# Altium schematic sheet main.SchDoc: Main
size A4; Revision: 1; SheetNumber: 1; SheetTotal: 2
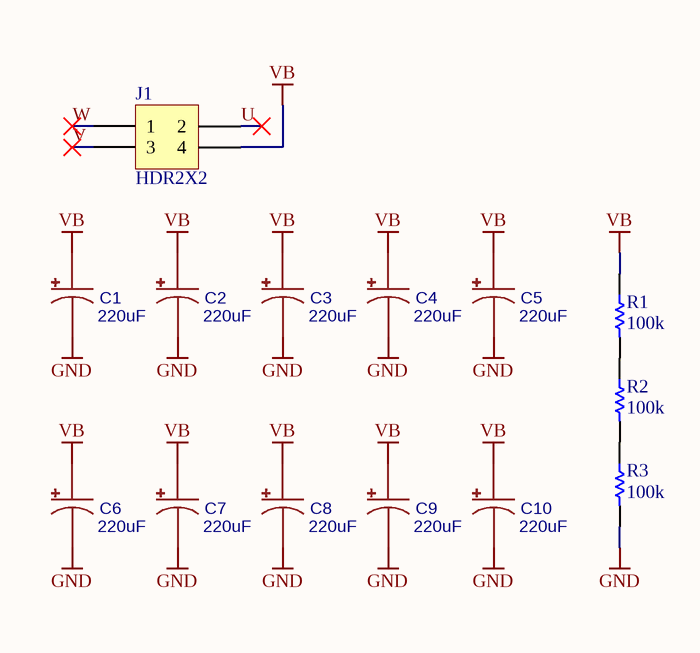
[diagram p0: main.SchDoc]

## Parts
C1  220uF  [CAP-TH_BD16.0-P7.50-D1.2-FD]
C2  220uF  [CAP-TH_BD16.0-P7.50-D1.2-FD]
C3  220uF  [CAP-TH_BD16.0-P7.50-D1.2-FD]
C4  220uF  [CAP-TH_BD16.0-P7.50-D1.2-FD]
C5  220uF  [CAP-TH_BD16.0-P7.50-D1.2-FD]
C6  220uF  [CAP-TH_BD16.0-P7.50-D1.2-FD]
C7  220uF  [CAP-TH_BD16.0-P7.50-D1.2-FD]
C8  220uF  [CAP-TH_BD16.0-P7.50-D1.2-FD]
C9  220uF  [CAP-TH_BD16.0-P7.50-D1.2-FD]
C10  220uF  [CAP-TH_BD16.0-P7.50-D1.2-FD]
J1  HDR2X2  [HDR-2X2]  (no BOM)
R1  100k  [R0805]
R2  100k  [R0805]
R3  100k  [R0805]

## Nets
GND: C1.2 C2.2 C3.2 C4.2 C5.2 C6.2 C7.2 C8.2 C9.2 C10.2 R3.2
VB: C1.1 C2.1 C3.1 C4.1 C5.1 C6.1 C7.1 C8.1 C9.1 C10.1 J1.4 R1.1
U: J1.2
V: J1.3
W: J1.1
NetR1_2: R1.2 R2.1
NetR2_2: R2.2 R3.1

## Library data of the parts
C1-C10 = 220uF: UPW2A221MHD
J1 = Header 2x2
R1-R3 = Res1: 100k 0805